# EAGLE design M207X (EAGLE 6.6.0)
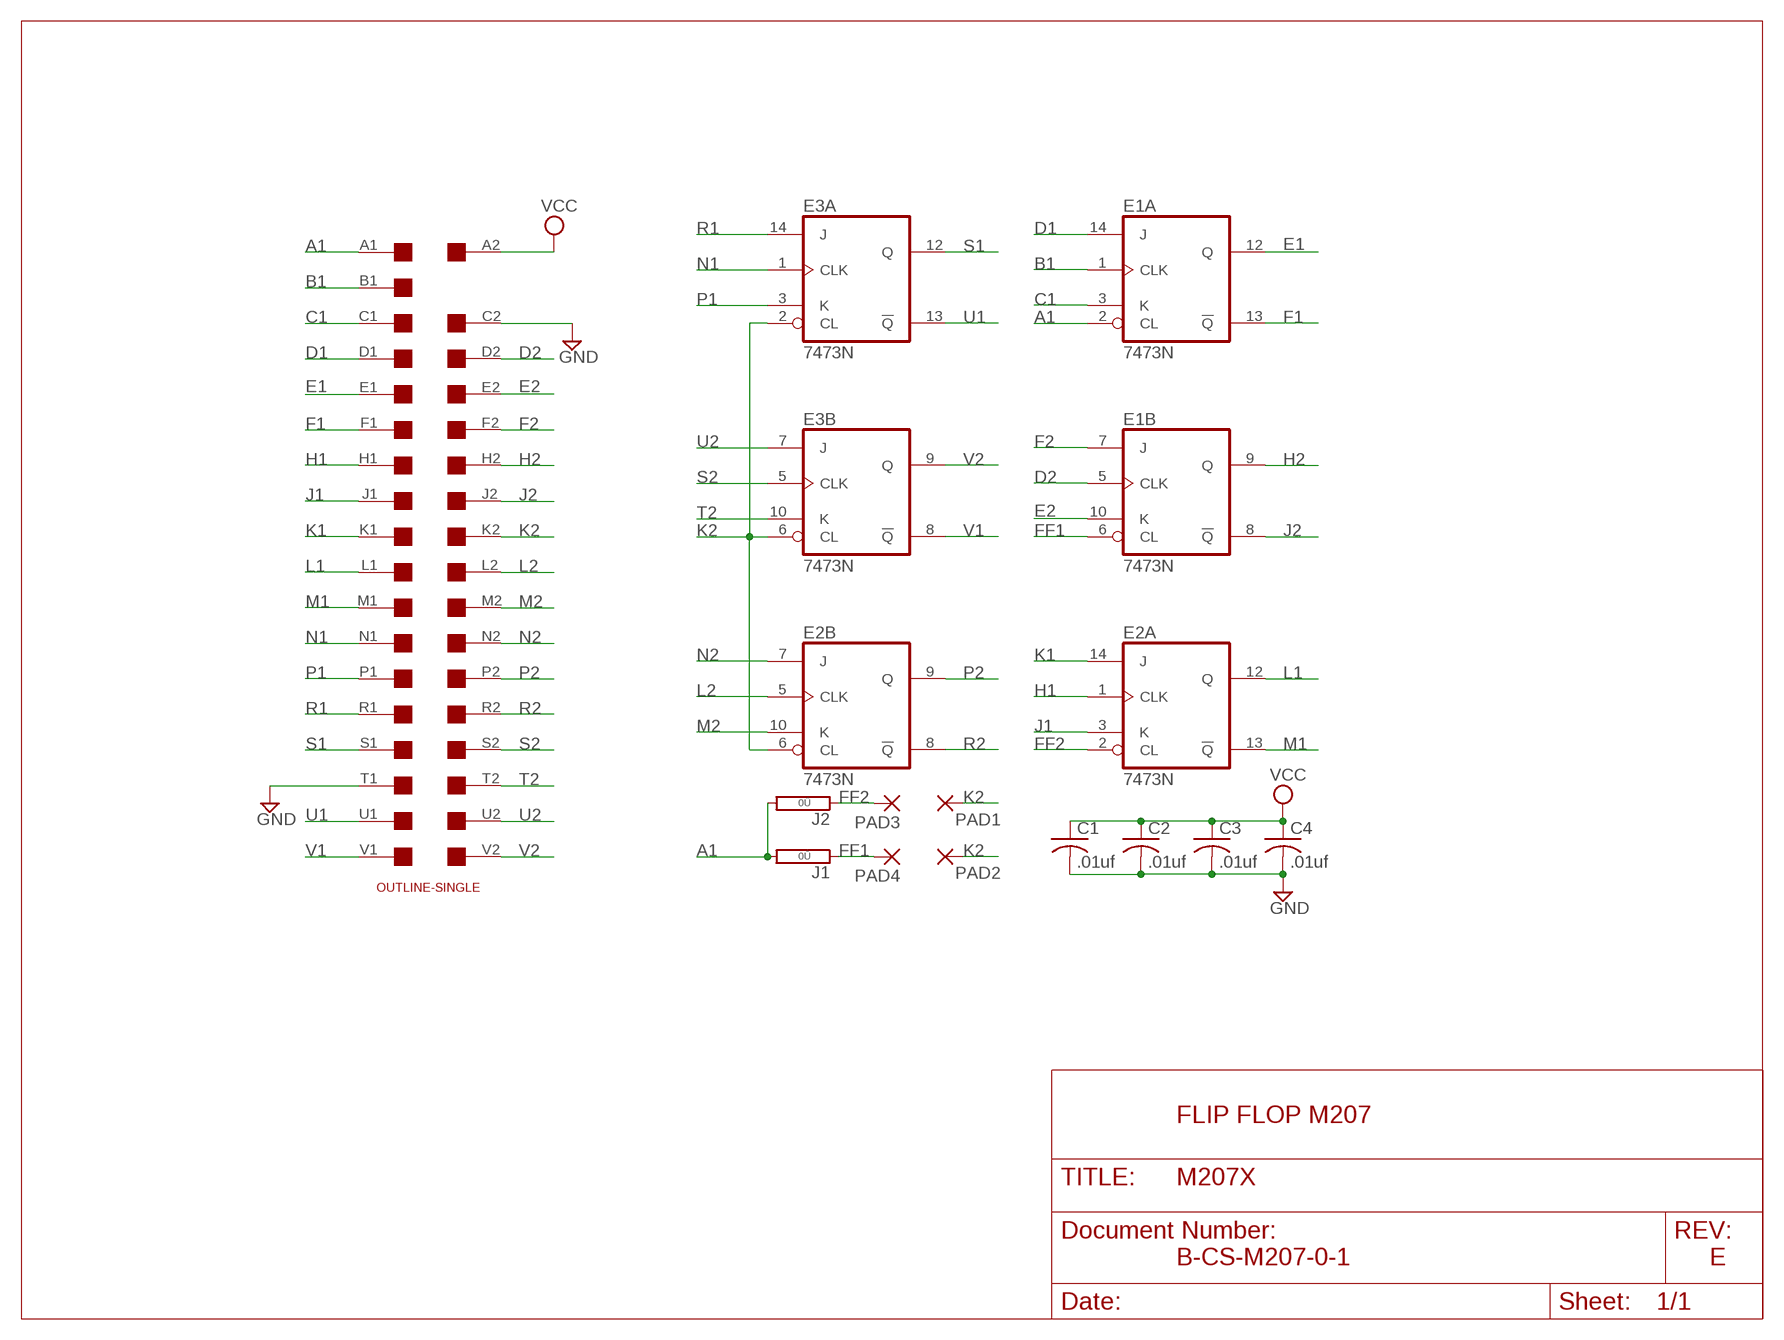
[diagram p0: schematic, sheet 1]

## Parts
C1  .01uf  C-US050-025X075  [C050-025X075]
C2  .01uf  C-US050-025X075  [C050-025X075]
C3  .01uf  C-US050-025X075  [C050-025X075]
C4  .01uf  C-US050-025X075  [C050-025X075]
E1  7473N  74LS73N  [DIL14]
E2  7473N  74LS73N  [DIL14]
E3  7473N  74LS73N  [DIL14]
J1  0R  [0R/10]
J2  0R  [0R/10]
PAD1  1,6/0,8  [1,6/0,8]
PAD2  1,6/0,8  [1,6/0,8]
PAD3  1,6/0,8  [1,6/0,8]
PAD4  1,6/0,8  [1,6/0,8]
U$1  SINGLE  [EDGE-CON2]
U$4  OUTLINE-SINGLE  [SINGLE]

## Nets
A1: E1.2(A:CL) J1.2 J2.2 U$1.A1
B1: E1.1(A:CLK) U$1.B1
C1: E1.3(A:K) U$1.C1
D1: E1.14(A:J) U$1.D1
D2: E1.5(B:CLK) U$1.D2
E1: E1.12(A:Q) U$1.E1
E2: E1.10(B:K) U$1.E2
F1: E1.13(A:!Q) U$1.F1
F2: E1.7(B:J) U$1.F2
FF1: E1.6(B:CL) J1.1 PAD4.1(P)
FF2: E2.2(A:CL) J2.1 PAD3.1(P)
GND [Supply]: C1.2 C2.2 C3.2 C4.2 U$1.C2 U$1.T1
H1: E2.1(A:CLK) U$1.H1
H2: E1.9(B:Q) U$1.H2
J1: E2.3(A:K) U$1.J1
J2: E1.8(B:!Q) U$1.J2
K1: E2.14(A:J) U$1.K1
K2: E2.6(B:CL) E3.2(A:CL) E3.6(B:CL) PAD1.1(P) PAD2.1(P) U$1.K2
L1: E2.12(A:Q) U$1.L1
L2: E2.5(B:CLK) U$1.L2
M1: E2.13(A:!Q) U$1.M1
M2: E2.10(B:K) U$1.M2
N1: E3.1(A:CLK) U$1.N1
N2: E2.7(B:J) U$1.N2
P1: E3.3(A:K) U$1.P1
P2: E2.9(B:Q) U$1.P2
R1: E3.14(A:J) U$1.R1
R2: E2.8(B:!Q) U$1.R2
S1: E3.12(A:Q) U$1.S1
S2: E3.5(B:CLK) U$1.S2
T2: E3.10(B:K) U$1.T2
U1: E3.13(A:!Q) U$1.U1
U2: E3.7(B:J) U$1.U2
V1: E3.8(B:!Q) U$1.V1
V2: E3.9(B:Q) U$1.V2
VCC [Supply]: C1.1 C2.1 C3.1 C4.1 U$1.A2
Unconnected: U$1.B2

## Notes on the sheet
- FLIP FLOP M207
- B-CS-M207-0-1 | E

## Power pins joined to a net without a drawn wire
GND: E1.11(P:GND) E2.11(P:GND) E3.11(P:GND)
VCC: E1.4(P:VCC) E2.4(P:VCC) E3.4(P:VCC)

## Library data of the parts
C1-C4 = rcl:C-US: CAPACITOR, American symbol
E1-E3 = 74xx-us:74*73: Dual J-K FLIP FLOP, clear
J1 J2 = jumper:0R: Bridge 0R 10mm
PAD1-PAD4 = wirepad:1,6/0,8: THROUGH-HOLE PAD
U$1 = dec-con:SINGLE: Single-Height DEC board
U$4 = dec-con:OUTLINE-*: Board outlines for DEC boards.

## Net classes
1 Supply: width 0.813 mm

## Board
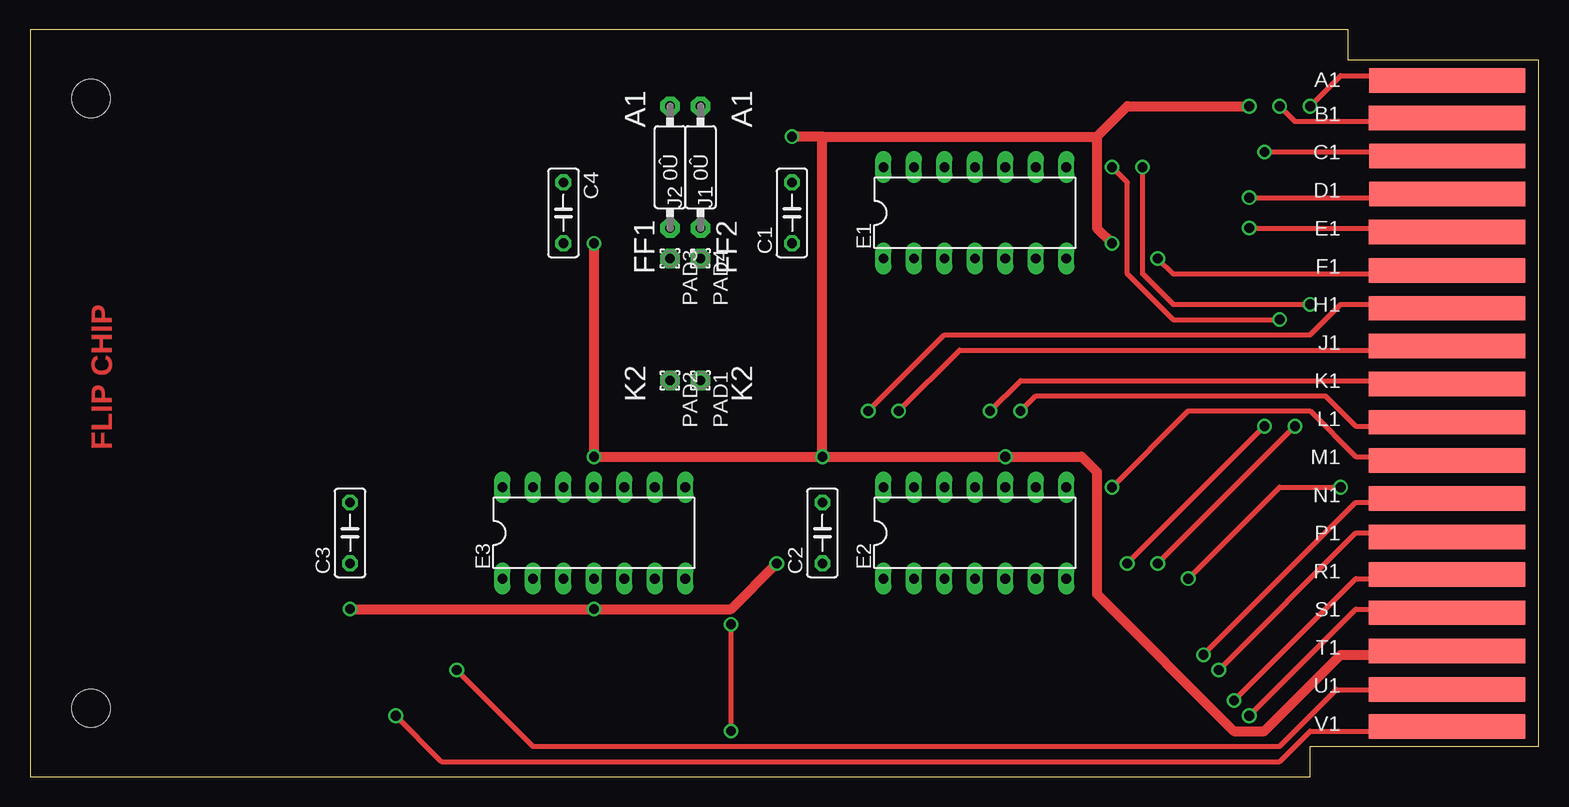
[diagram p1: board, top side]
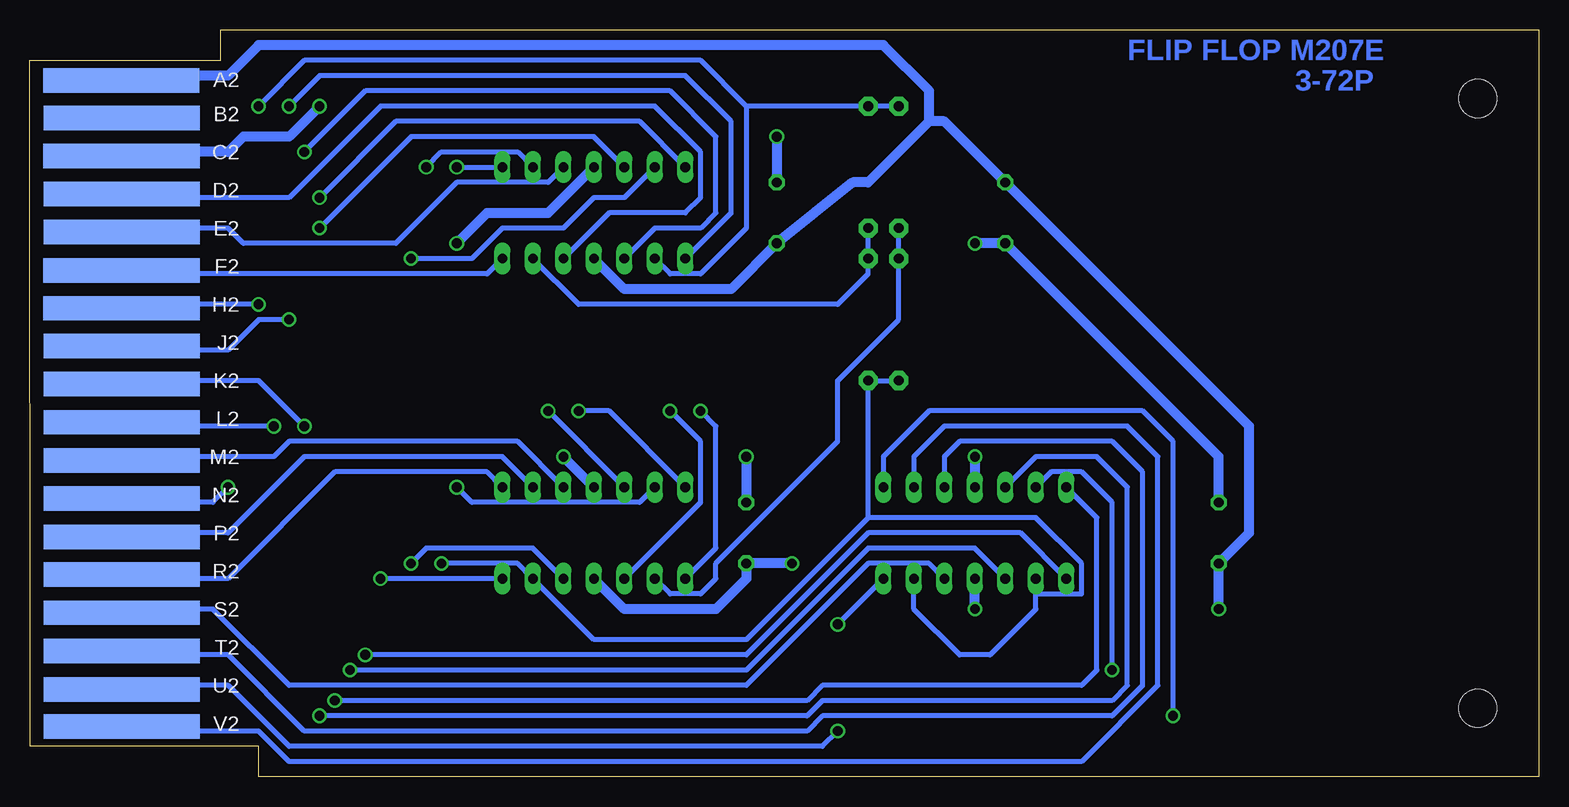
[diagram p2: board, bottom side, seen from below]

Size 125.73 x 62.23 mm. Coordinates in mm from the lower left corner, seen from the top.
Copper layers (1*16): Top 0.035mm / dielectric 1.5mm / Bottom 0.035mm
Design rules "16mils": minimum track width 16mil, minimum drill 32mil, track to track 15mil, track to pad 10mil, pad to pad 10mil, via to via 10mil, smd to smd 10mil, copper to edge 25mil, drill to drill 10mil, minimum pad ring 10mil, minimum via ring 8mil, stop-mask expansion 0mil, vias tented up to drill 0mil, thermal gap 10mil

### Footprints (pad centres in the part's own frame; a part is rotated, then mirrored left to right if it is on the bottom)
C050-025X075 = drill 0.813 octagon: 1 -2.54,0; 2 2.54,0
DIL14 = drill 0.813 long: 1 -7.62,-3.81; 2 -5.08,-3.81; 3 -2.54,-3.81; 4 0,-3.81; 5 2.54,-3.81; 6 5.08,-3.81; 7 7.62,-3.81; 8 7.62,3.81; 9 5.08,3.81; 10 2.54,3.81; 11 0,3.81; 12 -2.54,3.81; 13 -5.08,3.81; 14 -7.62,3.81
0R/10 = drill 0.813 pad 1.6 octagon: 1 -5.08,0; 2 5.08,0
1,6/0,8 = drill 0.813 pad 1.6 octagon: 1 0,0
EDGE-CON2 = smd 13.017 x 2.032: A1 7.633,4.207; B1 7.639,7.327; C1 7.636,10.489; D1 7.633,13.665; E1 7.642,16.84; F1 7.642,20.041; H1 7.642,23.19; J1 7.642,26.34; K1 7.642,29.515; L1 7.642,32.69; M1 7.642,35.89; N1 7.642,39.04; P1 7.642,42.24; R1 7.642,45.39; S1 7.642,48.565; T1 7.642,51.74; U1 7.642,54.966; V1 7.642,58.026 | smd 13.017 x 2.032 bottom: A2 7.614,4.207; B2 7.642,7.328; C2 7.617,10.49; D2 7.642,13.665; E2 7.642,16.84; F2 7.617,20.041; H2 7.617,23.19; J2 7.642,26.34; K2 7.642,29.515; L2 7.642,32.69; M2 7.642,35.89; N2 7.642,39.04; P2 7.642,42.24; R2 7.642,45.39; S2 7.642,48.565; T2 7.642,51.74; U2 7.642,54.966; V2 7.642,58.026
SINGLE = hole 3.175: 120.65,56.515; 120.65,5.715

### Placement (x,y rotation side)
C1  63.5,46.99 90 top
C2  66.04,20.32 90 top
C3  26.67,20.32 90 top
C4  44.45,46.99 270 top
E1  78.74,46.99 0 top
E2  78.74,20.32 0 top
E3  46.99,20.32 0 top
J1  55.88,50.8 90 top
J2  53.34,50.8 90 top
PAD1  55.88,33.02 270 top
PAD2  53.34,33.02 270 top
PAD3  53.34,43.18 270 top
PAD4  55.88,43.18 270 top
U$1  125.73,62.23 180 top
U$4  125.73,62.23 180 top

### Tracks (layer width: path | path; a pad name or v marks a point on that pad's centre or on a via)
A1  (via drill 0.81)
  Top 0.406: U$1.A1 112.16,58.02 111.76,58.42 109.22,58.42 v106.68,55.88
  Bottom 0.406: J2.2 J1.2 66.04,55.88 | E1.2 72.39,41.91 69.85,41.91 66.04,45.72 66.04,50.8 66.04,55.88 | v106.68,55.88 102.87,59.69 69.85,59.69 66.04,55.88
B1  (via drill 0.81)
  Top 0.406: U$1.B1 112.05,54.9 111.76,54.61 105.41,54.61 v104.14,55.88
  Bottom 0.406: v104.14,55.88 101.6,58.42 71.12,58.42 67.31,54.61 67.31,46.99 E1.1
C1  (via drill 0.81)
  Top 0.406: U$1.C1 112.09,51.74 111.76,52.07 v102.87,52.07
  Bottom 0.406: E1.3 73.66,45.72 69.85,45.72 68.58,46.99 68.58,53.34 72.39,57.15 97.79,57.15 v102.87,52.07
D1  (via drill 0.81)
  Top 0.406: U$1.D1 112.06,48.56 111.76,48.26 v101.6,48.26
  Bottom 0.406: E1.14 74.93,54.61 95.25,54.61 v101.6,48.26
D2
  Bottom 0.406: E1.5 77.47,46.99 71.12,46.99 69.85,48.26 69.85,52.07 73.66,55.88 96.52,55.88 104.14,48.26 111.76,48.26 112.06,48.56 U$1.D2
E1  (via drill 0.81)
  Top 0.406: U$1.E1 112.09,45.39 111.76,45.72 v101.6,45.72
  Bottom 0.406: E1.12 78.74,53.34 93.98,53.34 v101.6,45.72
E2
  Bottom 0.406: E1.10 82.55,49.53 90.17,49.53 95.25,44.45 107.95,44.45 109.22,45.72 111.76,45.72 112.09,45.39 U$1.E2
F1  (via drill 0.81)
  Top 0.406: U$1.F1 112.04,42.19 111.76,41.91 95.25,41.91 v93.98,43.18
  Bottom 0.406: E1.13 76.2,48.26 78.74,48.26 81.28,45.72 86.36,45.72 88.9,43.18 v93.98,43.18
F2
  Bottom 0.406: U$1.F2 112.04,42.19 111.76,41.91 87.63,41.91 E1.7
FF1
  Bottom 0.406: J1.1 PAD4.1 55.88,41.91 58.42,39.37 80.01,39.37 E1.6
FF2
  Bottom 0.406: J2.1 PAD3.1 53.34,38.1 58.42,33.02 58.42,27.94 68.58,17.78 68.58,16.51 69.85,15.24 72.39,15.24 E2.2
GND  (via drill 0.81)
  Top 0.813: v101.6,55.88 91.44,55.88 88.9,53.34 | 88.9,53.34 88.9,45.72 v90.17,44.45 | 66.04,53.34 v63.5,53.34 | 66.04,53.34 88.9,53.34 | v66.04,26.67 66.04,53.34 | v66.04,26.67 v46.99,26.67 v46.99,44.45 | v66.04,26.67 v81.28,26.67 87.63,26.67 88.9,25.4 88.9,15.24 100.33,3.81 102.87,3.81 109.22,10.16 111.76,10.16 112.09,10.49 U$1.T1
  Bottom 0.813: v46.99,26.67 E3.11 | E1.11 82.55,46.99 87.63,46.99 v90.17,44.45 | U$1.C2 112.09,51.74 111.76,52.07 109.22,52.07 107.95,53.34 104.14,53.34 v101.6,55.88 | v63.5,53.34 C1.2 | v66.04,26.67 C2.2 | v81.28,26.67 E2.11 | v46.99,44.45 C4.2 26.67,26.67 C3.2
H1  (via drill 0.81)
  Top 0.406: U$1.H1 112.09,39.04 111.76,39.37 109.22,39.37 106.68,36.83 76.2,36.83 v69.85,30.48
  Bottom 0.406: E2.1 68.58,19.05 68.58,29.21 v69.85,30.48
H2  (via drill 0.81)
  Top 0.406: v92.71,50.8 92.71,41.91 95.25,39.37 v106.68,39.37
  Bottom 0.406: E1.9 85.09,52.07 91.44,52.07 v92.71,50.8 | U$1.H2 112.09,39.04 111.76,39.37 v106.68,39.37
J1  (via drill 0.81)
  Top 0.406: U$1.J1 112.09,35.89 111.76,35.56 77.47,35.56 v72.39,30.48
  Bottom 0.406: E2.3 69.85,22.86 69.85,27.94 v72.39,30.48
J2  (via drill 0.81)
  Top 0.406: v90.17,50.8 91.44,49.53 91.44,41.91 95.25,38.1 v104.14,38.1
  Bottom 0.406: v90.17,50.8 E1.8 | v104.14,38.1 106.68,38.1 109.22,35.56 111.76,35.56 112.09,35.89 U$1.J2
K1  (via drill 0.81)
  Top 0.406: U$1.K1 112.06,32.72 111.76,33.02 82.55,33.02 v80.01,30.48
  Bottom 0.406: E2.14 77.47,30.48 v80.01,30.48
K2  (via drill 0.81)
  Top 0.406: v91.44,17.78 v102.87,29.21
  Bottom 0.406: PAD2.1 PAD1.1 55.88,21.59 | 55.88,21.59 41.91,21.59 38.1,17.78 38.1,15.24 41.91,15.24 | 41.91,15.24 41.91,13.97 45.72,10.16 48.26,10.16 52.07,13.97 E3.6 | 41.91,15.24 E3.2 | 55.88,21.59 66.04,11.43 78.74,11.43 E2.6 85.09,17.78 v91.44,17.78 | U$1.K2 112.06,32.72 111.76,33.02 106.68,33.02 v102.87,29.21
L1  (via drill 0.81)
  Top 0.406: U$1.L1 112.09,29.54 111.76,29.21 110.49,29.21 107.95,31.75 83.82,31.75 v82.55,30.48
  Bottom 0.406: E2.12 v82.55,30.48
L2  (via drill 0.81)
  Top 0.406: v93.98,17.78 v105.41,29.21
  Bottom 0.406: E2.5 83.82,19.05 92.71,19.05 v93.98,17.78 | U$1.L2 112.09,29.54 111.76,29.21 v105.41,29.21
M1  (via drill 0.81)
  Top 0.406: U$1.M1 112.09,26.34 111.76,26.67 110.49,26.67 106.68,30.48 96.52,30.48 v90.17,24.13
  Bottom 0.406: E2.13 74.93,22.86 88.9,22.86 v90.17,24.13
M2
  Bottom 0.406: U$1.M2 112.09,26.34 111.76,26.67 105.41,26.67 104.14,27.94 85.09,27.94 E2.10
N1  (via drill 0.81)
  Top 0.406: U$1.N1 112.09,23.19 111.76,22.86 110.49,22.86 v97.79,10.16
  Bottom 0.406: E3.1 43.18,20.32 55.88,20.32 66.04,10.16 v97.79,10.16
N2  (via drill 0.81)
  Top 0.406: v109.22,24.13 104.14,24.13 v96.52,16.51
  Bottom 0.406: E2.7 v96.52,16.51 | U$1.N2 112.09,23.19 111.76,22.86 110.49,22.86 v109.22,24.13
P1  (via drill 0.81)
  Top 0.406: U$1.P1 112.09,19.99 111.76,20.32 110.49,20.32 v99.06,8.89
  Bottom 0.406: E3.3 46.99,19.05 55.88,19.05 66.04,8.89 v99.06,8.89
P2
  Bottom 0.406: U$1.P2 112.09,19.99 111.76,20.32 109.22,20.32 102.87,26.67 86.36,26.67 E2.9
R1  (via drill 0.81)
  Top 0.406: U$1.R1 111.76,16.51 110.49,16.51 v100.33,6.35
  Bottom 0.406: v100.33,6.35 60.96,6.35 59.69,7.62 38.1,7.62 36.83,8.89 36.83,21.59 E3.14
R2
  Bottom 0.406: U$1.R2 112.09,16.84 111.76,16.51 109.22,16.51 100.33,25.4 87.63,25.4 E2.8
S1  (via drill 0.81)
  Top 0.406: U$1.S1 112.06,13.66 111.76,13.97 110.49,13.97 v101.6,5.08
  Bottom 0.406: v101.6,5.08 60.96,5.08 59.69,6.35 35.56,6.35 34.29,7.62 34.29,24.13 36.83,26.67 41.91,26.67 E3.12
S2
  Bottom 0.406: U$1.S2 111.76,13.97 110.49,13.97 104.14,7.62 66.04,7.62 55.88,17.78 50.8,17.78 E3.5
T2
  Bottom 0.406: U$1.T2 112.09,10.49 111.76,10.16 109.22,10.16 102.87,3.81 60.96,3.81 59.69,5.08 35.56,5.08 33.02,7.62 33.02,25.4 35.56,27.94 48.26,27.94 49.53,26.67 E3.10
U1  (via drill 0.81)
  Top 0.406: U$1.U1 108.86,7.26 104.14,2.54 41.91,2.54 v35.56,8.89
  Bottom 0.406: E3.13 40.64,25.4 38.1,25.4 35.56,22.86 v35.56,8.89
U2  (via drill 0.81)
  Top 0.406: v58.42,3.81 v58.42,12.7
  Bottom 0.406: U$1.U2 111.76,7.62 109.22,7.62 104.14,2.54 59.69,2.54 v58.42,3.81 | v58.42,12.7 E3.7
V1  (via drill 0.81)
  Top 0.406: U$1.V1 112.15,4.2 111.76,3.81 106.68,3.81 104.14,1.27 34.29,1.27 v30.48,5.08
  Bottom 0.406: E3.8 54.61,26.67 50.8,30.48 33.02,30.48 30.48,27.94 v30.48,5.08
V2
  Bottom 0.406: U$1.V2 111.76,4.2 111.76,3.81 106.68,3.81 104.14,1.27 38.1,1.27 31.75,7.62 31.75,26.67 34.29,29.21 49.53,29.21 52.07,26.67 E3.9
VCC  (via drill 0.81)
  Top 0.813: v26.67,13.97 v46.99,13.97 58.42,13.97 v62.23,17.78
  Bottom 0.813: U$1.A2 112.16,58.02 111.76,58.42 109.22,58.42 106.68,60.96 54.61,60.96 50.8,57.15 50.8,54.61 | 50.8,54.61 55.88,49.53 57.15,49.53 C1.1 67.31,40.64 76.2,40.64 E1.4 | 50.8,54.61 49.53,54.61 C4.1 24.13,29.21 24.13,20.32 C3.1 v26.67,13.97 | v46.99,13.97 E3.4 | v62.23,17.78 C2.1 66.04,16.51 68.58,13.97 76.2,13.97 E2.4

### Text on the board
Top: FLIP CHIP
Bottom: FLIP FLOP M207E | 3-72P
tPlace: A1 | A1 | FF1 | FF2 | K2 | K2